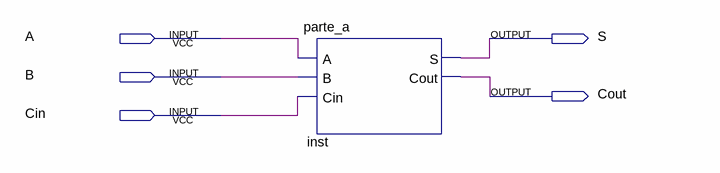
[diagram p0: schematic sheet]
// Quartus schematic parte_a_symbol.bdf as structural Verilog: 1 symbols, 5 pins
module parte_a_symbol (
  input  A,
  input  B,
  input  Cin,
  output S,
  output Cout
);

  parte_a inst (.A(A), .B(B), .Cin(Cin), .S(S), .Cout(Cout));
endmodule
